# EAGLE schematic CurrentMonitor2 (EAGLE 6.4)
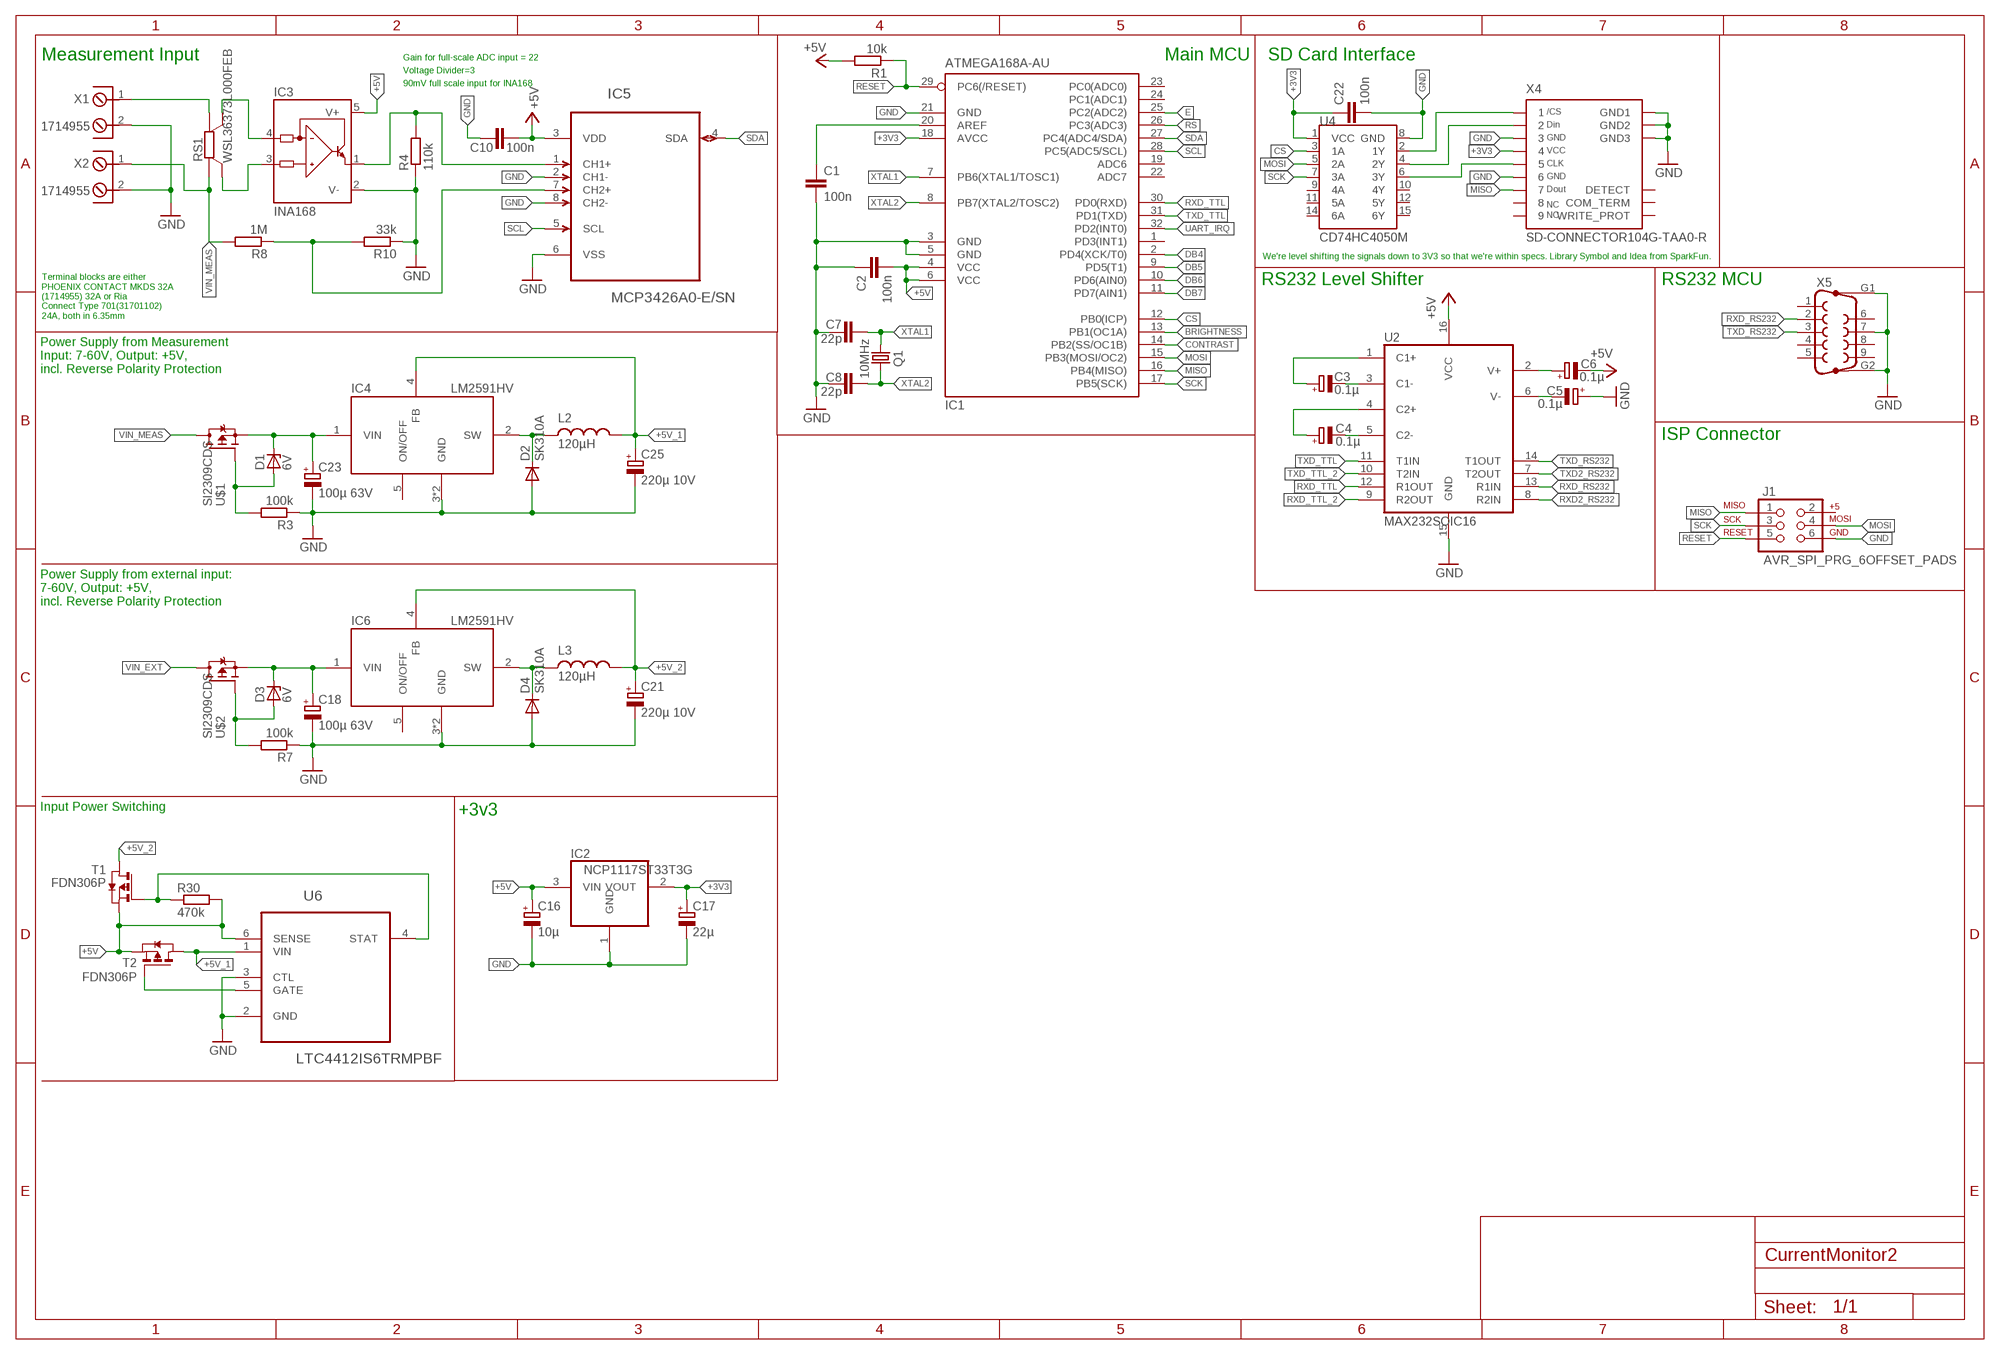
[diagram p0: schematic, sheet 1, part 1 of 2]
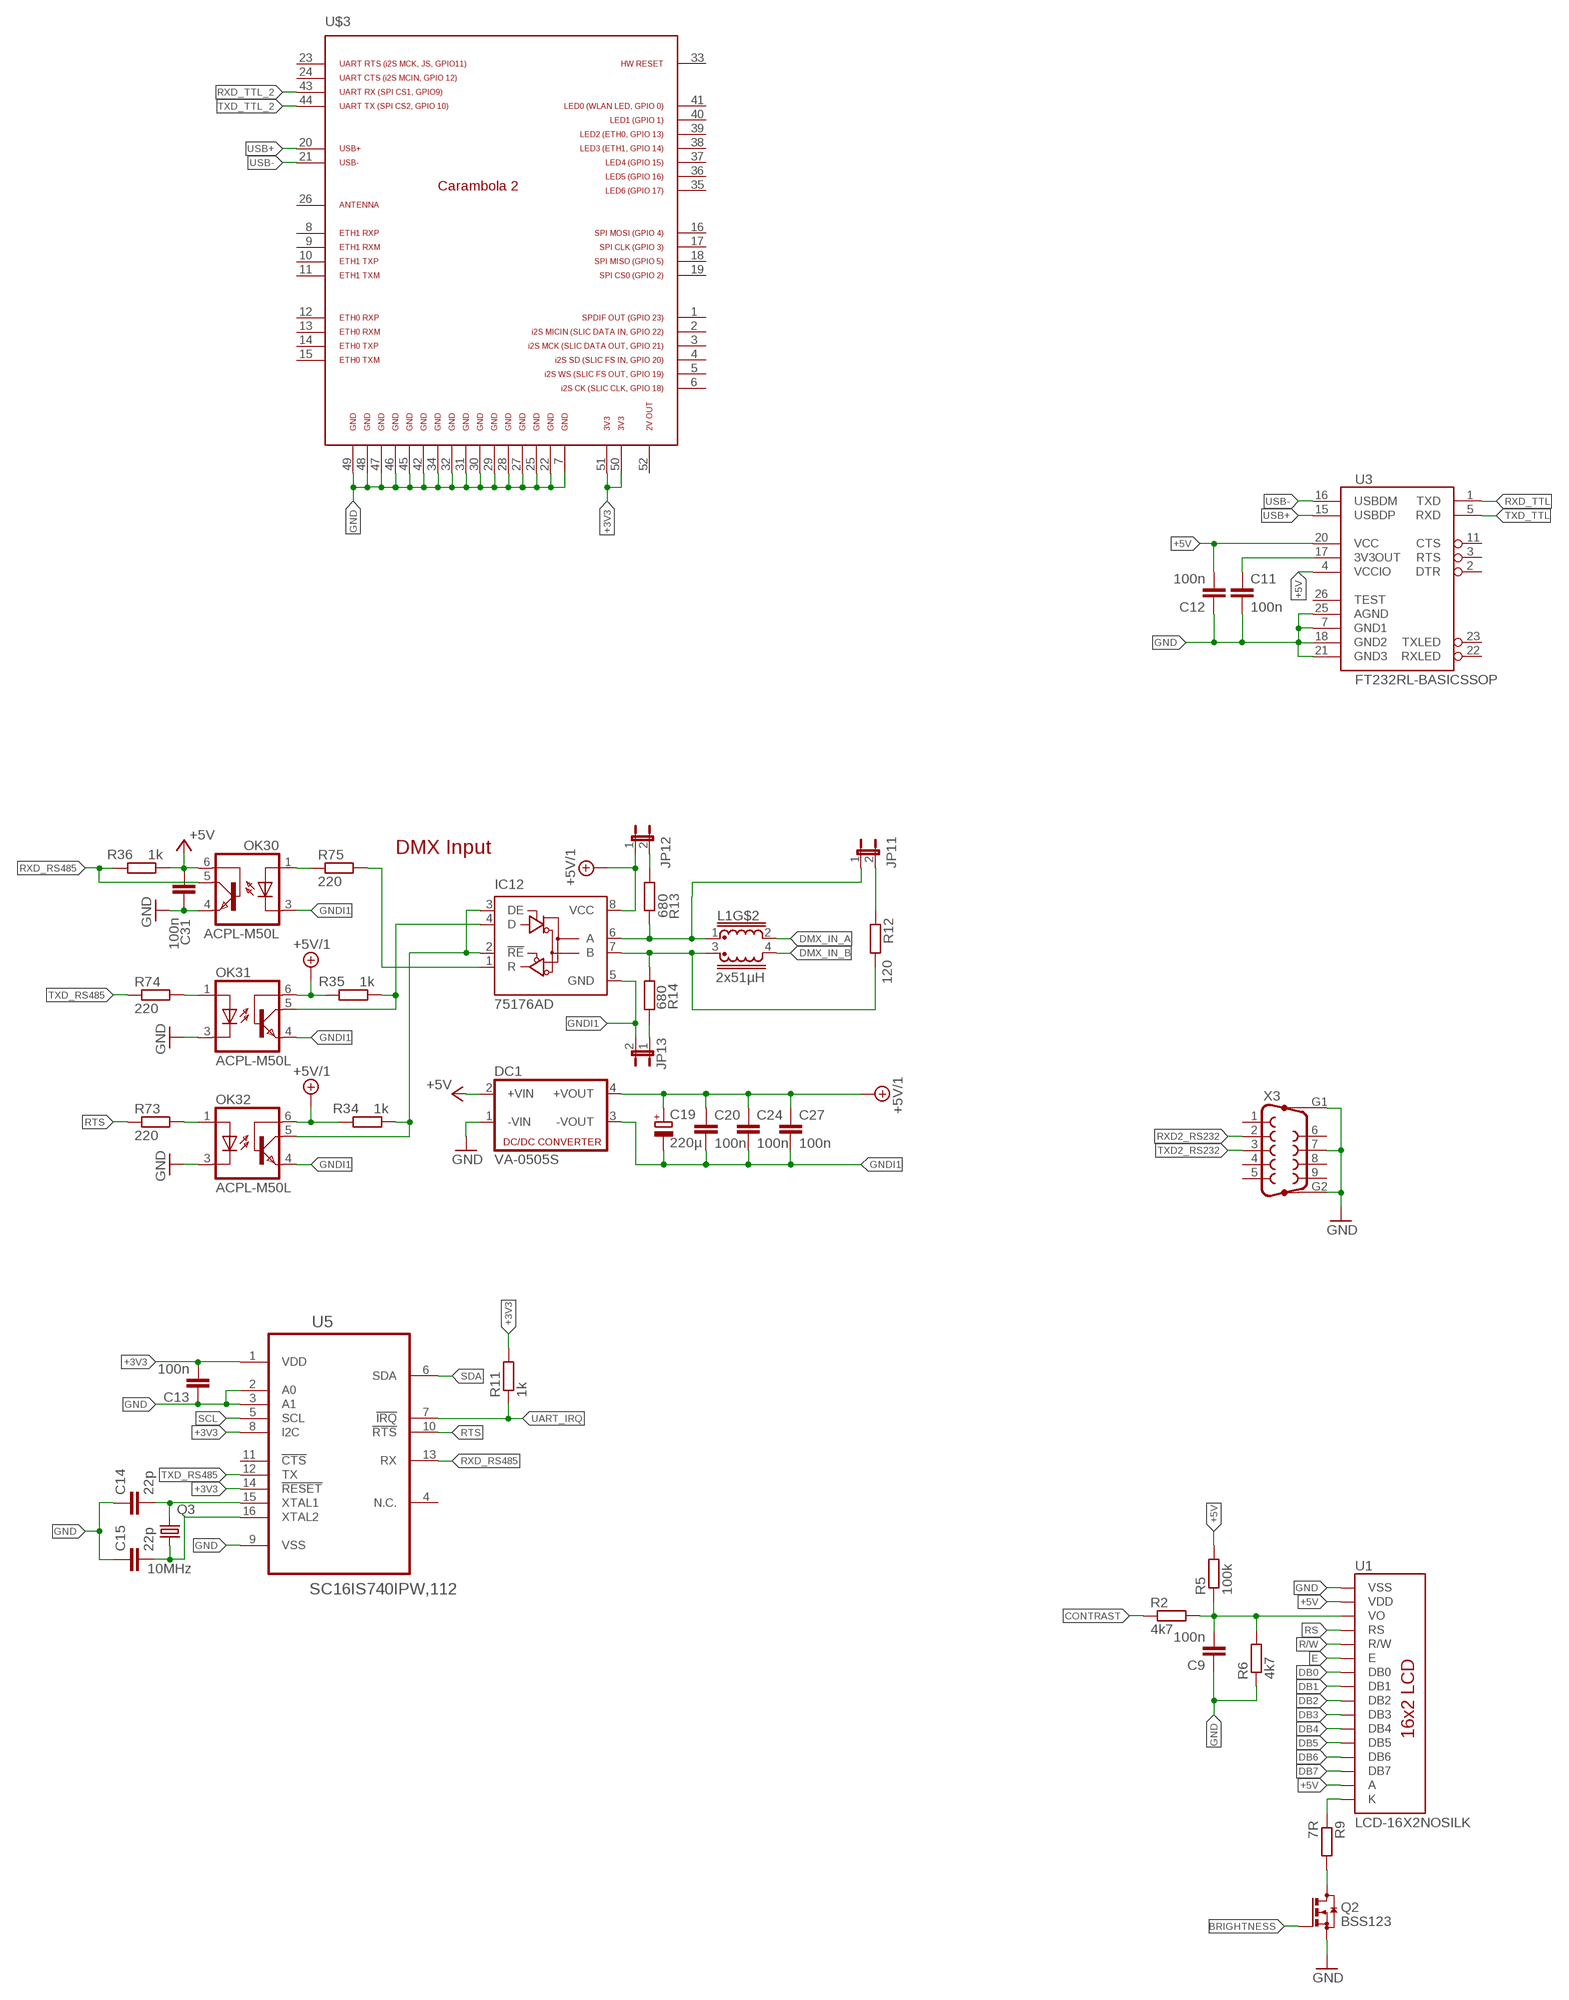
[diagram p1: schematic, sheet 1, part 2 of 2]

## Parts
C1  100n  C-EUC0805  [C0805]
C2  100n  C-EUC0805  [C0805]
C3  0.1µ  CPOL-EUB  [PANASONIC_B]
C4  0.1µ  CPOL-EUB  [PANASONIC_B]
C5  0.1µ  CPOL-EUB  [PANASONIC_B]
C6  0.1µ  CPOL-EUB  [PANASONIC_B]
C7  22p  C-EUC0805  [C0805]
C8  22p  C-EUC0805  [C0805]
C9  100n  C-EUC0805  [C0805]
C10  100n  C-EUC0805  [C0805]
C11  100n  C-EUC0805  [C0805]
C12  100n  C-EUC0805  [C0805]
C13  100n  C-EUC0805  [C0805]
C14  22p  C-EUC0805  [C0805]
C15  22p  C-EUC0805  [C0805]
C16  10µ  CPOL-EUB  [PANASONIC_B]
C17  22µ  CPOL-EUB  [PANASONIC_B]
C18  100µ 63V  CPOL-EUG  [PANASONIC_G]
C19  220µ  CPOL-EUD  [PANASONIC_D]
C20  100n  C-EUC0805  [C0805]
C21  220µ 10V  CPOL-EUD  [PANASONIC_D]
C22  100n  C-EUC0805  [C0805]
C23  100µ 63V  CPOL-EUG  [PANASONIC_G]
C24  100n  C-EUC0805  [C0805]
C25  220µ 10V  CPOL-EUD  [PANASONIC_D]
C27  100n  C-EUC0805  [C0805]
C31  100n  C-EUC0805  [C0805]
D1  6V  ZENER-DIODESOT23  [SOT23]
D2  SK310A  DIODE-DO214AC  [DO214AC]
D3  6V  ZENER-DIODESOT23  [SOT23]
D4  SK310A  DIODE-DO214AC  [DO214AC]
DC1  VA-0505S  [4SIL]
IC1  ATMEGA168A-AU  MEGA8-AI  [TQFP32-08]
IC2  NCP1117ST33T3G  REG1117  [SOT223]
IC3  INA168  INA138  [SOT23-5]
IC4  LM2591HV  [TO263-5]
IC5  MCP3426A0-E/SN  [SOIC127P600X175-8N]
IC6  LM2591HV  [TO263-5]
IC12  75176AD  [D_R-PDSO-G8]
J1  AVR_SPI_PRG_6OFFSET_PADS  [2X3_OFFSET]
JP11  JP1E  [JP1]
JP12  JP1E  [JP1]
JP13  JP1E  [JP1]
L1  2x51µH  EPCOS_B82790C0  [EPCOS_B82790_SERIES]
L2  120µH  MSS1260  [MSS1260]
L3  120µH  MSS1260  [MSS1260]
OK30  ACPL-M50L  [JEDEC_MS-012-AA_SOIC5]
OK31  ACPL-M50L  [JEDEC_MS-012-AA_SOIC5]
OK32  ACPL-M50L  [JEDEC_MS-012-AA_SOIC5]
Q1  10MHz  CRYSTALHC49UP  [HC49UP]
Q2  BSS123  [SOT23]
Q3  10MHz  CRYSTALHC49UP  [HC49UP]
R1  10k  R-EU_R0805  [R0805]
R2  4k7  R-EU_R0805  [R0805]
R3  100k  R-EU_R0805  [R0805]
R4  110k  R-EU_R0805  [R0805]
R5  100k  R-EU_R0805  [R0805]
R6  4k7  R-EU_R0805  [R0805]
R7  100k  R-EU_R0805  [R0805]
R8  1M  R-EU_R0805  [R0805]
R9  7R  R-EU_R0805  [R0805]
R10  33k  R-EU_R0805  [R0805]
R11  1k  R-EU_R0805  [R0805]
R12  120  R-EU_R0805  [R0805]
R13  680  R-EU_R0805  [R0805]
R14  680  R-EU_R0805  [R0805]
R30  470k  R-EU_R0805  [R0805]
R34  1k  R-EU_R0805  [R0805]
R35  1k  R-EU_R0805  [R0805]
R36  1k  R-EU_R0805  [R0805]
R73  220  R-EU_R0805  [R0805]
R74  220  R-EU_R0805  [R0805]
R75  220  R-EU_R0805  [R0805]
RS1  WSL36373L000FEB  SHUNT-4CSM3675M  [CSM3637M]
T1  FDN306P  PMOSSOT23  [SOT-23]
T2  FDN306P  PMOSSOT23  [SOT-23]
U1  LCD-16X2NOSILK  [LCD-16X2_NOSILK]
U2  MAX232SOIC16  [SO016]
U3  FT232RL-BASICSSOP  [SSOP28DB]
U4  CD74HC4050M  HEX_CONVERTER  [SO016]
U5  SC16IS740IPW,112  [SOP65P640X110-16N]
U6  LTC4412IS6TRMPBF  [SOT95P280X100-6N]
U$1  SI2309CDS  [SOT23]
U$2  SI2309CDS  [SOT23]
U$3  CARAMBOLA2  [CARAMBOLA2]
X1  1714955  AKL701_213  [AKL701_2_13]
X2  1714955  AKL701_213  [AKL701_2_13]
X3  F09HP  [F09HP]
X4  SD-CONNECTOR104G-TAA0-R  [104G-TAA0-R]
X5  F09HP  [F09HP]

## Nets
+3V3 [medpower]: C1.1 C13.2 C17.+ C22.1 IC1.18(AVCC) IC1.20(AREF) IC2.2(VOUT) R11.2 U4.1(VCC) U5.1(VDD) U5.8(I2C) U5.14(!RESET) U$3.50 U$3.51 X4.4
+5V: C2.2 C6.- C10.1 C12.2 C16.+ C31.1 DC1.2(+VIN) IC1.4(VCC) IC1.6(VCC) IC2.3(VIN) IC3.5(V+) IC5.3(VDD) OK30.6(BAS) R1.2 R5.2 R30.2 R36.1 T1.2(S) T2.2(S) U1.2(VDD) U1.15(A) U2.16(VCC) U3.4(VCCIO) U3.20(VCC) U6.6(SENSE)
+5V_1: C25.+ IC4.4(FB) L2.P$1 T2.1(D) U6.1(VIN)
+5V_2: C21.+ IC6.4(FB) L3.P$1 T1.1(D)
ADC0: IC3.1(OUT) IC5.1(CH1+) R4.2
ADC1: IC5.7(CH2+) R8.1 R10.2
BRIGHTNESS: IC1.13(PB1(OC1A)) Q2.1(G)
CONTRAST: IC1.14(PB2(SS/OC1B)) R2.1
CS: IC1.12(PB0(ICP)) U4.3(1A)
DB0: U1.7(DB0)
DB1: U1.8(DB1)
DB2: U1.9(DB2)
DB3: U1.10(DB3)
DB4: IC1.2(PD4(XCK/T0)) U1.11(DB4)
DB5: IC1.9(PD5(T1)) U1.12(DB5)
DB6: IC1.10(PD6(AIN0)) U1.13(DB6)
DB7: IC1.11(PD7(AIN1)) U1.14(DB7)
DMX_IN_A: L1.2
DMX_IN_B: L1.4
E: IC1.25(PC2(ADC2)) U1.6(E)
GND: C1.2 C2.1 C5.+ C7.1 C8.1 C9.1 C10.2 C11.2 C12.1 C13.1 C14.1 C15.1 C16.- C17.- C18.- C21.- C22.2 C23.- C25.- C31.2 D2.A D4.A DC1.1(-VIN) IC1.3(GND) IC1.5(GND) IC1.21(GND) IC2.1(GND) IC3.2(V-) IC4.3(GND) IC4.6(GND) IC5.2(CH1-) IC5.6(VSS) IC5.8(CH2-) IC6.3(GND) IC6.6(GND) J1.6 OK30.4(EMI) OK31.3(C) OK32.3(C) Q2.2(S) R3.1 R4.1 R6.1 R7.1 R10.1 U1.1(VSS) U2.15(GND) U3.7(GND1) U3.18(GND2) U3.21(GND3) U3.25(AGND) U4.8(GND) U5.2(A0) U5.3(A1) U5.9(VSS) U6.2(GND) U6.3(CTL) U$3.7 U$3.22 U$3.25 U$3.27 U$3.28 U$3.29 U$3.30 U$3.31 U$3.32 U$3.34 U$3.42 U$3.45 U$3.46 U$3.47 U$3.48 U$3.49 X1.2 X2.2 X3.7 X3.G1 X3.G2 X4.3 X4.6 X4.GND1 X4.GND2 X4.GND3 X5.7 X5.G1 X5.G2
GNDI1: C19.- C20.2 C24.2 C27.2 DC1.3(-VOUT) IC12.5(GND) JP13.2 OK30.3(C) OK31.4(EMI) OK32.4(EMI)
MISO: IC1.16(PB4(MISO)) J1.1 X4.7
MOSI: IC1.15(PB3(MOSI/OC2)) J1.4 U4.5(2A)
N$1 [highpower]: IC3.3(IN+) RS1.S2
N$2 [highpower]: IC3.4(IN-) RS1.S1
N$3: D3.1(A) R7.2 U$2.1(G)
N$4: D1.1(A) R3.2 U$1.1(G)
N$5 [highpower]: RS1.I1 X1.1
N$6: C6.+ U2.2(V+)
N$7: D4.C IC6.2(SW) L3.P$2
N$8: R30.1 T1.3(G) U6.4(STAT)
N$9: C5.- U2.6(V-)
N$10: D2.C IC4.2(SW) L2.P$2
N$11: C3.- U2.3(C1-)
N$12: C4.- U2.5(C2-)
N$13: C4.+ U2.4(C2+)
N$14: C3.+ U2.1(C1+)
N$15: T2.3(G) U6.5(GATE)
N$16: Q2.3(D) R9.2
N$17: C11.1 U3.17(3V3OUT)
N$21: C14.2 Q3.2 U5.15(XTAL1)
N$22: C15.2 Q3.1 U5.16(XTAL2)
N$27: U4.2(1Y) X4.1
N$28: U4.4(2Y) X4.2
N$29: R9.1 U1.16(K)
N$30: U4.6(3Y) X4.5
N$53: IC12.6(A) JP11.1 L1.1 R13.1
N$85: JP12.2 R13.2
N$86: JP13.1 R14.1
N$89: JP11.2 R12.1
N$101: IC12.7(B) L1.3 R12.2 R14.2
N$104: OK30.1(A) R75.1
N$116: OK31.1(A) R74.2
N$133: OK32.1(A) R73.2
R/W: U1.5(R/W)
RE_OUT: IC12.2(!RE) IC12.3(DE) OK32.5(COL) R34.1
REC$1: IC12.1(R) R75.2
RESET: IC1.29(PC6(/RESET)) J1.5 R1.1
RS: IC1.26(PC3(ADC3)) U1.4(RS)
RTS: R73.1 U5.10(!RTS)
RXD2_RS232: U2.8(R2IN) X3.2
RXD_RS232: U2.13(R1IN) X5.2
RXD_RS485: OK30.5(COL) R36.2 U5.13(RX)
RXD_TTL: IC1.30(PD0(RXD)) U2.12(R1OUT) U3.1(TXD)
RXD_TTL_2: U2.9(R2OUT) U$3.43
SCK: IC1.17(PB5(SCK)) J1.3 U4.7(3A)
SCL: IC1.28(PC5(ADC5/SCL)) IC5.5(SCL) U5.5(SCL)
SDA: IC1.27(PC4(ADC4/SDA)) IC5.4(SDA) U5.6(SDA)
TXD2_RS232: U2.7(T2OUT) X3.3
TXD_OUT: IC12.4(D) OK31.5(COL) R35.1
TXD_RS232: U2.14(T1OUT) X5.3
TXD_RS485: R74.1 U5.12(TX)
TXD_TTL: IC1.31(PD1(TXD)) U2.11(T1IN) U3.5(RXD)
TXD_TTL_2: U2.10(T2IN) U$3.44
UART_IRQ: IC1.32(PD2(INT0)) R11.1 U5.7(!IRQ)
USB+: U3.15(USBDP) U$3.20
USB-: U3.16(USBDM) U$3.21
VCCIO1: C19.+ C20.1 C24.1 C27.1 DC1.4(+VOUT) IC12.8(VCC) JP12.1 OK31.6(BAS) OK32.6(BAS) R34.2 R35.2 ; supply symbol labelled +5V/1
VIN: C23.+ D1.3(C) IC4.1(VIN) U$1.2(S)
VIN1: C18.+ D3.3(C) IC6.1(VIN) U$2.2(S)
VIN_EXT [highpower]: U$2.3(D)
VIN_MEAS [highpower]: R8.2 RS1.I2 U$1.3(D) X2.1
VO: C9.2 R2.2 R5.1 R6.2 U1.3(VO)
XTAL1: C7.2 IC1.7(PB6(XTAL1/TOSC1)) Q1.2
XTAL2: C8.2 IC1.8(PB7(XTAL2/TOSC2)) Q1.1
Unconnected: IC1.1(PD3(INT1)) IC1.19(ADC6) IC1.22(ADC7) IC1.23(PC0(ADC0)) IC1.24(PC1(ADC1)) IC4.5(ON/OFF) IC6.5(ON/OFF) J1.2 U3.2(DTR) U3.3(RTS) U3.11(CTS) U3.22(RXLED) U3.23(TXLED) U3.26(TEST) U4.9(4A) U4.10(4Y) U4.11(5A) U4.12(5Y) U4.14(6A) U4.15(6Y) U5.4(N.C.) U5.11(!CTS) U$3.1 U$3.2 U$3.3 U$3.4 U$3.5 U$3.6 U$3.8 U$3.9 U$3.10 U$3.11 U$3.12 U$3.13 U$3.14 U$3.15 U$3.16 U$3.17 U$3.18 U$3.19 U$3.23 U$3.24 U$3.26 U$3.33 U$3.35 U$3.36 U$3.37 U$3.38 U$3.39 U$3.40 U$3.41 U$3.52 X3.1 X3.4 X3.5 X3.6 X3.8 X3.9 X4.8 X4.9 X4.CD(DETECT) X4.COMMON(COM_TERM) X4.WRITE_PROTECT(WRITE_PROT) X5.1 X5.4 X5.5 X5.6 X5.8 X5.9

## Notes on the sheet
- Measurement Input | Gain for full-scale ADC input = 22 | Main MCU | SD Card Interface
- Voltage Divider=3
- 90mV full scale input for INA168
- We're level shifting the signals down to 3V3 so that we're within specs. Library Symbol and Idea from SparkFun.
- RS232 Level Shifter | RS232 MCU
- Terminal blocks are either
  PHOENIX CONTACT MKDS 32A
  (1714955) 32A or Ria
  Connect Type 701(31701102)
  24A, both in 6.35mm
- DMX Input
- Power Supply from Measurement
  Input: 7-60V, Output: +5V,
  incl. Reverse Polarity Protection
- ISP Connector
- Power Supply from external input:
  7-60V, Output: +5V,
  incl. Reverse Polarity Protection
- Input Power Switching
- +3v3

## Library data of the parts
C1 C2 C22 = resistor:C-EU: CAPACITOR, European symbol; OC_FARNELL: 1759985; PRICE_100: 0.005
C3-C6 = rcl:CPOL-EU: POLARIZED CAPACITOR, European symbol; OC_FARNELL: 9697039RL; PRICE_100: 0.074
C7 C8 = rcl:C-EU: CAPACITOR, European symbol; OC_FARNELL: 1759195RL; PRICE_100: 0.005
C9 C11-C13 = resistor:C-EU: CAPACITOR, European symbol
C10 = resistor:C-EU: CAPACITOR, European symbol; OC_DIGIKEY: 1276-1007-6-ND; OC_FARNELL: 1759985; PRICE_100: 0.005
C14 C15 C20 C24 C27 C31 = rcl:C-EU: CAPACITOR, European symbol
C16 = rcl:CPOL-EU: POLARIZED CAPACITOR, European symbol; OC_FARNELL: 2069174RL; PRICE_100: 0.085
C17 = rcl:CPOL-EU: POLARIZED CAPACITOR, European symbol; OC_FARNELL: 2068649RL; PRICE_100: 0.069
C18 C23 = rcl:CPOL-EU: POLARIZED CAPACITOR, European symbol; OC_FARNELL: 9696040RL; PRICE_100: 0.293
C19 = rcl:CPOL-EU: POLARIZED CAPACITOR, European symbol; OC_REICHELT: VF 220/6,3 K-D
C21 C25 = rcl:CPOL-EU: POLARIZED CAPACITOR, European symbol; OC_FARNELL: 1539464RL; PRICE_100: 0.207
D1 D3 = diode:ZENER-DIODE: Z-Diode
D2 D4 = diode:DIODE-: DIODE; OC_FARNELL: 1299279RL; PRICE_100: 0.5
DC1 = dc-dc-converter:VA-*?: DC DC Converter Single Output, 1 Watt Motien Technology Co.,Ltd. Source: va-serie.pdf; OC_FARNELL: unknown; OC_NEWARK: unknown
IC1 = atmel:MEGA8: MICROCONTROLLER 8 Kbytes FLASH, 1 kbytes SRAM, 512 bytes EEPROM, USART, 6-channel 10 bit ADC, 2-channel 8 bit ADC Pin compatible with Atmega48, ATMega88, ATMega168 Source: avr.lbr; MPN: ATMEGA8-16AU; OC_FARNELL: 1841603; OC_NEWARK: 73M8863; PRICE_100: 1.32
IC2 = burr-brown:REG1117: 800mA and 1A Low Dropout (LDO) Positive Regulator 1.8V, 2.5V, 2.85V, 3.3V, 5V, and Adj; MPN: REG1117; OC_FARNELL: 1652366RL; OC_NEWARK: 14P6981; PRICE_100: 0.207
IC3 = burr-brown:INA138: High-Side Measurement Current Shunt Monitor; MF: TEXAS INSTRUMENTS; MPN: INA138NA/250; OC_DIGIKEY: INA168NADKR-ND; OC_FARNELL: 1206907RL; OC_NEWARK: 80K5906; PRICE_100: 1.18
IC4 IC6 = LM2591:LM2591HV; OC_DIGIKEY: LM2591HVSX-5.0/NOPBCT-ND; PRICE_100: 2.0529
IC5 = MCP3428:MCP3426A0-E/SN: Analog-to-Digital Converter; MPN: MCP3426A0-E/SN; OC_DIGIKEY: MCP3426A0-E/SN-ND; OC_FARNELL: 1825012; OC_NEWARK: 52R9954; PACKAGE: SOIC-8; PRICE_100: 1.93; SUPPLIER: Microchip
IC12 = 751xx:75176A: DIFFERENTIAL BUS TRANSCEIVER Source: http://focus.ti.com/lit/ds/symlink/sn75176a.pdf
J1 = SparkFun:AVR_SPI_PRG_6: AVR ISP 6 Pin This is the reduced ISP connector for AVR programming. Common on Arduino. This footprint will take up less PCB space and can be used with a 10-pin to 6-pin adapter such as SKU: BOB-08508; OC_FARNELL: 2215302; PRICE_100: 0.17
JP11-JP13 = jumper:JP1E: JUMPER
L1 = epcos-b82790c0:EPCOS_B82790C0: EPCOS B82790C0 Data and Signal Line Common Mode Choke
L2 L3 = inductor-coilcraft:MSS1260: SMT Power Inductor; OC_FARNELL: 2288407; PRICE_100: 0.90
OK30-OK32 = ACPL-M50L:ACPL-M50L
Q1 = crystal:CRYSTAL: CRYSTAL; OC_FARNELL: 1842273RL; OC_NEWARK: unknown; PRICE_100: 0.248
Q2 = transistor-small-signal:BSS123: N-CHANNEL MOS FET
Q3 = crystal:CRYSTAL: CRYSTAL; OC_FARNELL: unknown; OC_NEWARK: unknown
R1 R30 = rcl:R-EU_: RESISTOR, European symbol; OC_FARNELL: 2129195; PRICE_100: 0.001
R2 R3 R5-R7 R9 R11-R14 = rcl:R-EU_: RESISTOR, European symbol
R4 = rcl:R-EU_: RESISTOR, European symbol; OC_FARNELL: 2129278; PRICE_100: 0.001
R8 = rcl:R-EU_: RESISTOR, European symbol; OC_FARNELL: 2129354; PRICE_100: 0.001
R10 = rcl:R-EU_: RESISTOR, European symbol; OC_FARNELL: 2129237; PRICE_100: 0.001
R34-R36 R73-R75 = resistor:R-EU_: RESISTOR, European symbol
RS1 = R-Vishay:SHUNT-4; OC_DIGIKEY: WSLI-.003DKR-ND; OC_FARNELL: 1107417RL; PRICE_100: 0.747
T1 T2 = zetex:PMOSSOT23: MOS FET; OC_FARNELL: unknown; OC_NEWARK: unknown
U1 = SparkFun:LCD-16X2
U2 = SparkFun:MAX232: RS232 Transceiver Very common IC. This is generically called 'MAX232', but works with the 3V equivalent MAX3232 generic ICs. Field tested and mother approved. Spark Fun Electronics SKU : COM-00316 (DIP) and COM-00589 (SMD); OC_FARNELL: 1470443; PRICE_100: 0.486
U3 = SparkFun:FT232RL-BASIC: USB UART This is the simplified version of the FT232RL unit. Only what you need, nothing you don't. Spark Fun Electronics SKU : COM-00650
U4 = SparkFun:HEX_CONVERTER; OC_FARNELL: 1085272; PRICE_100: 0.158
U5 = MCP3428:SC16IS740IPW,112: IC, UART FIFO 5MBPS 3.6V 16TSSOP; MPN: SC16IS740IPW,112; OC_FARNELL: 2101308; OC_NEWARK: 70R8982; PACKAGE: 16TSSOP; SUPPLIER: NXP
U6 = LTC4412:LTC4412IS6TRMPBF: Low Loss PowerPathTM Controller; MPN: LTC4412IS6#TRMPBF; OC_FARNELL: 1663918; OC_NEWARK: 56M9522; PACKAGE: SOT-23-6; SUPPLIER: LINEAR TECHNOLOGY
U$1 U$2 = Si2309CDS:SI2309CDS
U$3 = Carambola2:CARAMBOLA2
X1 X2 = _con_riacon_akl701:AKL701_2*: RIACON (Ria Connect) Screw Type Terminal Block Type AKL 701 - 2 (pole-size: 2) centerline 6.35 mm / 0.250 inches, 400 V / 24 A, horizontal wire entry, lift system, modular packages: _13: recommended pcb hole dia. = 1,3 mm _15: pcb hole dia. = 1,5 mm (prototyping) Auhtor: Dipl.-Ing. FH Rainer Bayer, Hochschule Heilbronn (rainer.bayer@hs-heilbronn.de); OC_DIGIKEY: 277-1269-ND; OC_FARNELL: 3704683; PRICE_100: 0.901
X3 = con-subd:F09HP: SUB-D; OC_FARNELL: unknown; OC_NEWARK: unknown
X4 = con-sd-attend:SD-CONNECTOR; OC_TME: MCC-SD/2; PRICE_100: 0.9
X5 = con-subd:F09HP: SUB-D; OC_FARNELL: 1653978; OC_NEWARK: unknown; PRICE_100: 0.75

## Net classes
1 highpower: width 0.305 mm
2 medpower: width 0.305 mm